# EAGLE schematic scheme (EAGLE 9.6.2)

## Sheet 1 of 2
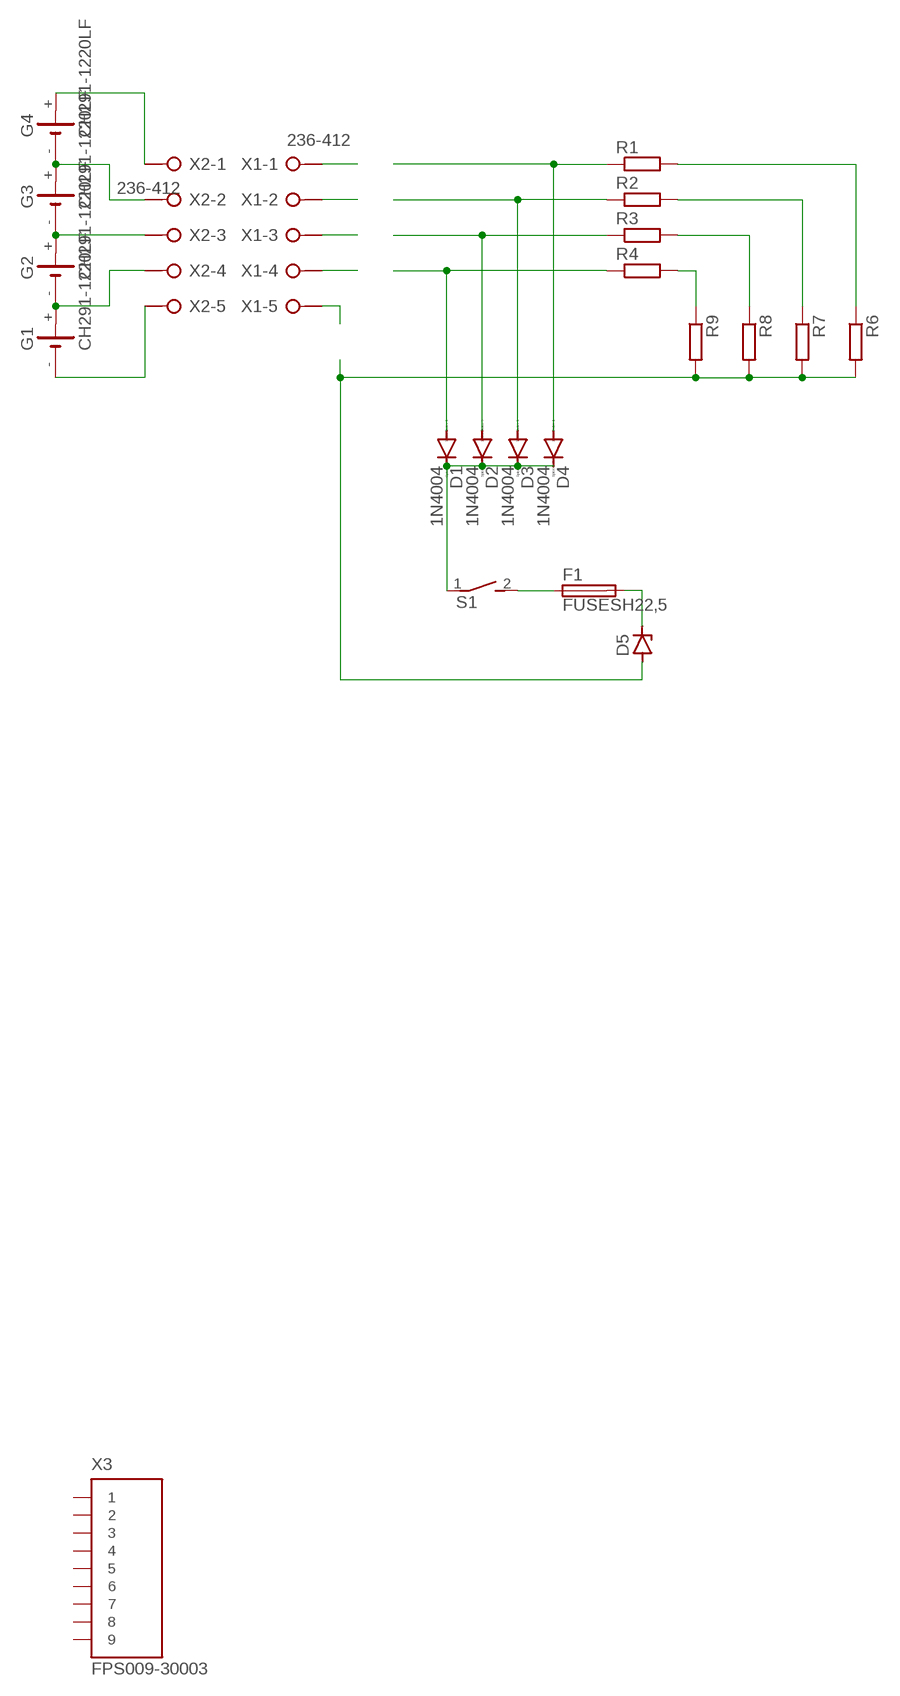
[diagram p0: schematic, sheet 1]

### Parts
D1  1N4004  [DO41-10]
D2  1N4004  [DO41-10]
D3  1N4004  [DO41-10]
D4  1N4004  [DO41-10]
D5  ZENER-DIODEDO41Z10  [DO41Z10]
F1  FUSESH22,5  [SH22,5]
G1  CH291-1220LF  [CH291-1220LF]
G2  CH291-1220LF  [CH291-1220LF]
G3  CH291-1220LF  [CH291-1220LF]
G4  CH291-1220LF  [CH291-1220LF]
R1  R-EU_0204/7  [0204/7]
R2  R-EU_0204/7  [0204/7]
R3  R-EU_0204/7  [0204/7]
R4  R-EU_0204/7  [0204/7]
R6  R-EU_0204/7  [0204/7]
R7  R-EU_0204/7  [0204/7]
R8  R-EU_0204/7  [0204/7]
R9  R-EU_0204/7  [0204/7]
S1  DS01E  [DS-01]
X1  236-412  [236-412]
X2  236-412  [236-412]
X3  FPS009-30003  [FPS009-3003]

### Nets
N$1: D4.A R1.1
N$2: R4.2 R9.1
N$3: D3.A R2.1
N$4: D2.A R3.1
N$5: D1.A R4.1
N$6: R3.2 R8.1
N$7: R2.2 R7.1
N$8: R1.2 R6.1
N$10: D1.C D2.C D3.C D4.C S1.1
N$11: F1.1 S1.2
N$12: D5.C F1.2
N$13: G1.+ G2.- X2.4@1(-4:KL1)
N$14: G2.+ G3.- X2.3@1(-3:KL1)
N$15: G3.+ G4.- X2.2@1(-2:KL1)
N$16: G4.+ X2.1@1(-1:KL1)
N$17: G1.- X2.5@1(-5:KL1)
N$18: D5.A R6.2 R7.2 R8.2 R9.2
N$19: X1.1@1(-1:KL1)
N$20: X1.2@1(-2:KL1)
N$21: X1.3@1(-3:KL1)
N$22: X1.4@1(-4:KL1)
N$23: X1.5@1(-5:KL1)
Unconnected: X1.1@2(-1:KL2) X1.2@2(-2:KL2) X1.3@2(-3:KL2) X1.4@2(-4:KL2) X1.5@2(-5:KL2) X1.6@1(-6:KL1) X1.6@2(-6:KL2) X1.7@1(-7:KL1) X1.7@2(-7:KL2) X1.8@1(-8:KL1) X1.8@2(-8:KL2) X1.9@1(-9:KL1) X1.9@2(-9:KL2) X1.10@1(-10:KL1) X1.10@2(-10:KL2) X1.11@1(-11:KL1) X1.11@2(-11:KL2) X1.12@1(-12:KL1) X1.12@2(-12:KL2) X2.1@2(-1:KL2) X2.2@2(-2:KL2) X2.3@2(-3:KL2) X2.4@2(-4:KL2) X2.5@2(-5:KL2) X2.6@1(-6:KL1) X2.6@2(-6:KL2) X2.7@1(-7:KL1) X2.7@2(-7:KL2) X2.8@1(-8:KL1) X2.8@2(-8:KL2) X2.9@1(-9:KL1) X2.9@2(-9:KL2) X2.10@1(-10:KL1) X2.10@2(-10:KL2) X2.11@1(-11:KL1) X2.11@2(-11:KL2) X2.12@1(-12:KL1) X2.12@2(-12:KL2) X3.1 X3.2 X3.3 X3.4 X3.5 X3.6 X3.7 X3.8 X3.9

## Sheet 2 of 2
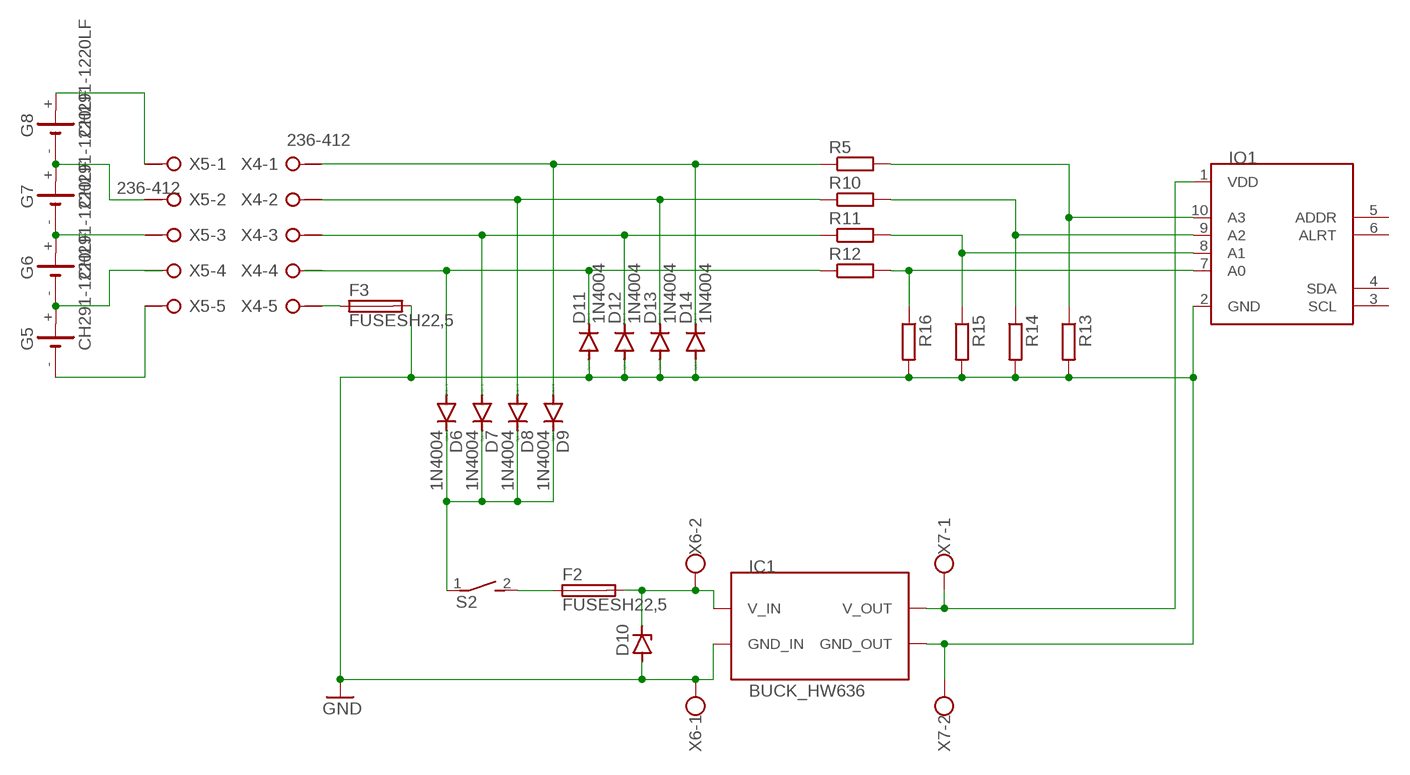
[diagram p1: schematic, sheet 2]

### Parts
D6  1N4004  [DO41-10]
D7  1N4004  [DO41-10]
D8  1N4004  [DO41-10]
D9  1N4004  [DO41-10]
D10  ZENER-DIODEDO41Z10  [DO41Z10]
D11  1N4004  [DO41-10]
D12  1N4004  [DO41-10]
D13  1N4004  [DO41-10]
D14  1N4004  [DO41-10]
F2  FUSESH22,5  [SH22,5]
F3  FUSESH22,5  [SH22,5]
G5  CH291-1220LF  [CH291-1220LF]
G6  CH291-1220LF  [CH291-1220LF]
G7  CH291-1220LF  [CH291-1220LF]
G8  CH291-1220LF  [CH291-1220LF]
IC1  BUCK_HW636  (no package)
IO1  ADC_ADS1115  [10PIN]
R5  R-EU_0204/7  [0204/7]
R10  R-EU_0204/7  [0204/7]
R11  R-EU_0204/7  [0204/7]
R12  R-EU_0204/7  [0204/7]
R13  R-EU_0204/7  [0204/7]
R14  R-EU_0204/7  [0204/7]
R15  R-EU_0204/7  [0204/7]
R16  R-EU_0204/7  [0204/7]
S2  DS01E  [DS-01]
X4  236-412  [236-412]
X5  236-412  [236-412]
X6  W237-102  [W237-102]
X7  W237-102  [W237-102]

### Nets
GND: D10.A D11.A D12.A D13.A D14.A F3.2 IC1.GND_IN IC1.GND_OUT IO1.2(GND) R13.2 R14.2 R15.2 R16.2 X6.1 X7.2
N$9: IO1.8(A1) R11.2 R15.1
N$24: IO1.9(A2) R10.2 R14.1
N$25: IO1.10(A3) R5.2 R13.1
N$26: IO1.7(A0) R12.2 R16.1
N$27: D6.C D7.C D8.C D9.C S2.1
N$28: F2.1 S2.2
N$29: D10.C F2.2 IC1.V_IN X6.2
N$30: G5.+ G6.- X5.4@1(-4:KL1) X5.4@2(-4:KL2)
N$31: G7.+ G8.- X5.2@1(-2:KL1)
N$32: G8.+ X5.1@1(-1:KL1)
N$33: G6.+ G7.- X5.3@1(-3:KL1)
N$34: IC1.V_OUT IO1.1(VDD) X7.1
N$35: D9.A D14.C R5.1 X4.1@1(-1:KL1)
N$36: D8.A D13.C R10.1 X4.2@1(-2:KL1)
N$37: F3.1 X4.5@1(-5:KL1)
N$38: D7.A D12.C R11.1 X4.3@1(-3:KL1)
N$39: D6.A D11.C R12.1 X4.4@1(-4:KL1) X4.4@2(-4:KL2)
N$40: G5.- X5.5@1(-5:KL1)
Unconnected: IO1.3(SCL) IO1.4(SDA) IO1.5(ADDR) IO1.6(ALRT) X4.1@2(-1:KL2) X4.2@2(-2:KL2) X4.3@2(-3:KL2) X4.5@2(-5:KL2) X4.6@1(-6:KL1) X4.6@2(-6:KL2) X4.7@1(-7:KL1) X4.7@2(-7:KL2) X4.8@1(-8:KL1) X4.8@2(-8:KL2) X4.9@1(-9:KL1) X4.9@2(-9:KL2) X4.10@1(-10:KL1) X4.10@2(-10:KL2) X4.11@1(-11:KL1) X4.11@2(-11:KL2) X4.12@1(-12:KL1) X4.12@2(-12:KL2) X5.1@2(-1:KL2) X5.2@2(-2:KL2) X5.3@2(-3:KL2) X5.5@2(-5:KL2) X5.6@1(-6:KL1) X5.6@2(-6:KL2) X5.7@1(-7:KL1) X5.7@2(-7:KL2) X5.8@1(-8:KL1) X5.8@2(-8:KL2) X5.9@1(-9:KL1) X5.9@2(-9:KL2) X5.10@1(-10:KL1) X5.10@2(-10:KL2) X5.11@1(-11:KL1) X5.11@2(-11:KL2) X5.12@1(-12:KL1) X5.12@2(-12:KL2)

## Library data of the parts
D1-D4 D6-D9 D11-D14 = diode:1N4004: DIODE general purpose rectifier, 1 A
D5 D10 = diode:ZENER-DIODE: Z-Diode
F1-F3 = fuse:FUSE: Fuse; OC_FARNELL: unknown; OC_NEWARK: unknown
G1-G8 = battery:CH291-1220LF: Battery Holder, SMT, 12mm multicomp PART NO. CH291-1220LF Source: Data sheet <http://www.farnell.com/datasheets/1505860.pdf>
IC1 = fslib:BUCK_HW636
IO1 = fslib:ADC_ADS1115
R1-R16 = rcl:R-EU_: RESISTOR, European symbol; SPICEPREFIX: R
S1 S2 = switch-dil:DS01E: DIL/CODE SWITCH; OC_FARNELL: unknown; OC_NEWARK: unknown
X1 X2 X4 X5 = con-wago-508:236-412: Terminal Strips 2.5 mm2/AWG 12, Series 236, Pin Spacings 5/5.08 mm Source: Data sheet <http://www.farnell.com/datasheets/63479.pdf>; MF: Wago Corporation; MPN: 0236-0412; OC_FARNELL: 1283531; OC_NEWARK: 79K2064
X3 = con-yamaichi:FPS009-30*: SD Card and MMC Reader (Manual Insertion) Source: http://www.yamaichi.de/pdf/c_fps009_3000.pdf; MPN: FPS009-3003-BL; OC_FARNELL: 1143953; OC_NEWARK: 91K9876
X6 X7 = con-wago-500:W237-102: WAGO SCREW CLAMP; MPN: 237-102; OC_FARNELL: unknown; OC_NEWARK: 70K9898